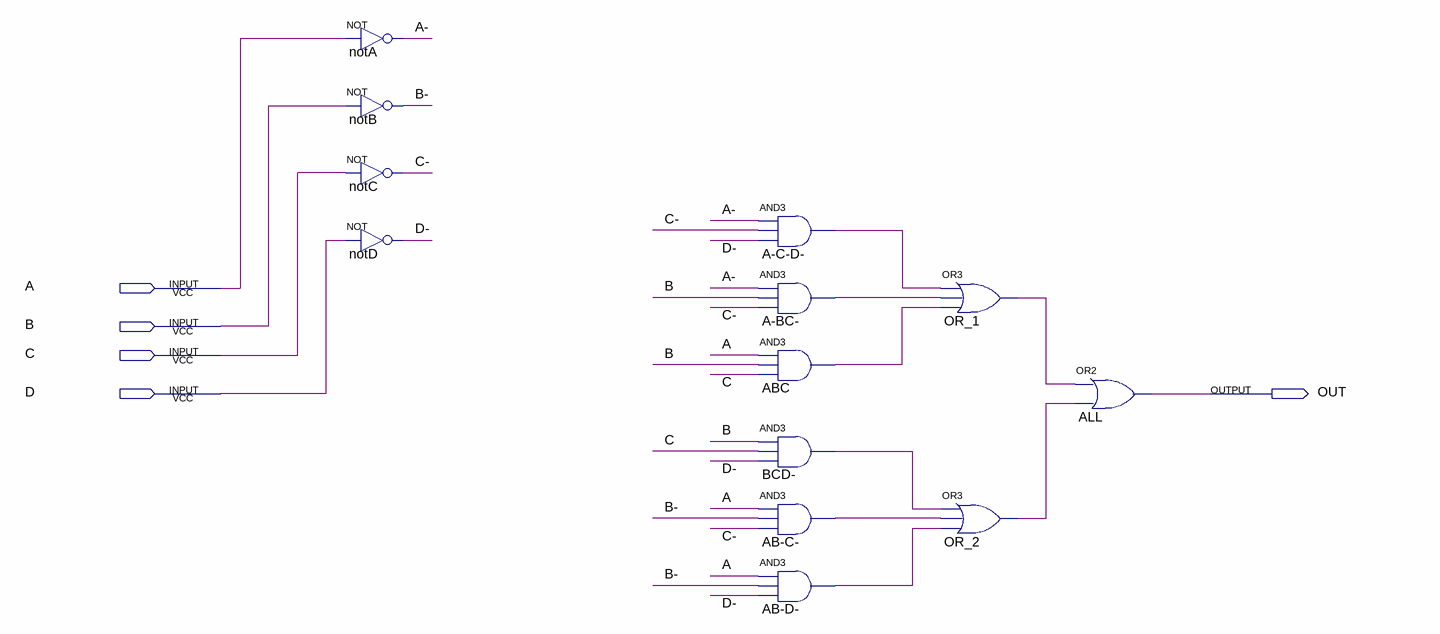
[diagram p0: schematic sheet]
// Quartus schematic f.bdf as structural Verilog: 13 symbols, 5 pins
module f (
  input  A,
  input  B,
  input  C,
  input  D,
  output OUT
);

  wire \A- , A_BC__out, A_C_D__out, AB_C__out, AB_D__out, ABC_out, \B- , BCD__out, \C- , \D- , OR_1_out,
       OR_2_out;

  not notA (\A- , A);
  not notB (\B- , B);
  not notC (\C- , C);
  not notD (\D- , D);
  and \A-C-D-  (A_C_D__out, \A- , \C- , \D- );
  and \A-BC-  (A_BC__out, \A- , B, \C- );
  and ABC (ABC_out, A, B, C);
  and \BCD-  (BCD__out, B, C, \D- );
  and \AB-C-  (AB_C__out, A, \B- , \C- );
  and \AB-D-  (AB_D__out, A, \B- , \D- );
  or OR_1 (OR_1_out, A_C_D__out, A_BC__out, ABC_out);
  or OR_2 (OR_2_out, BCD__out, AB_C__out, AB_D__out);
  or ALL (OUT, OR_1_out, OR_2_out);
endmodule
